# EAGLE design Module-Relay (EAGLE 6.6.0)
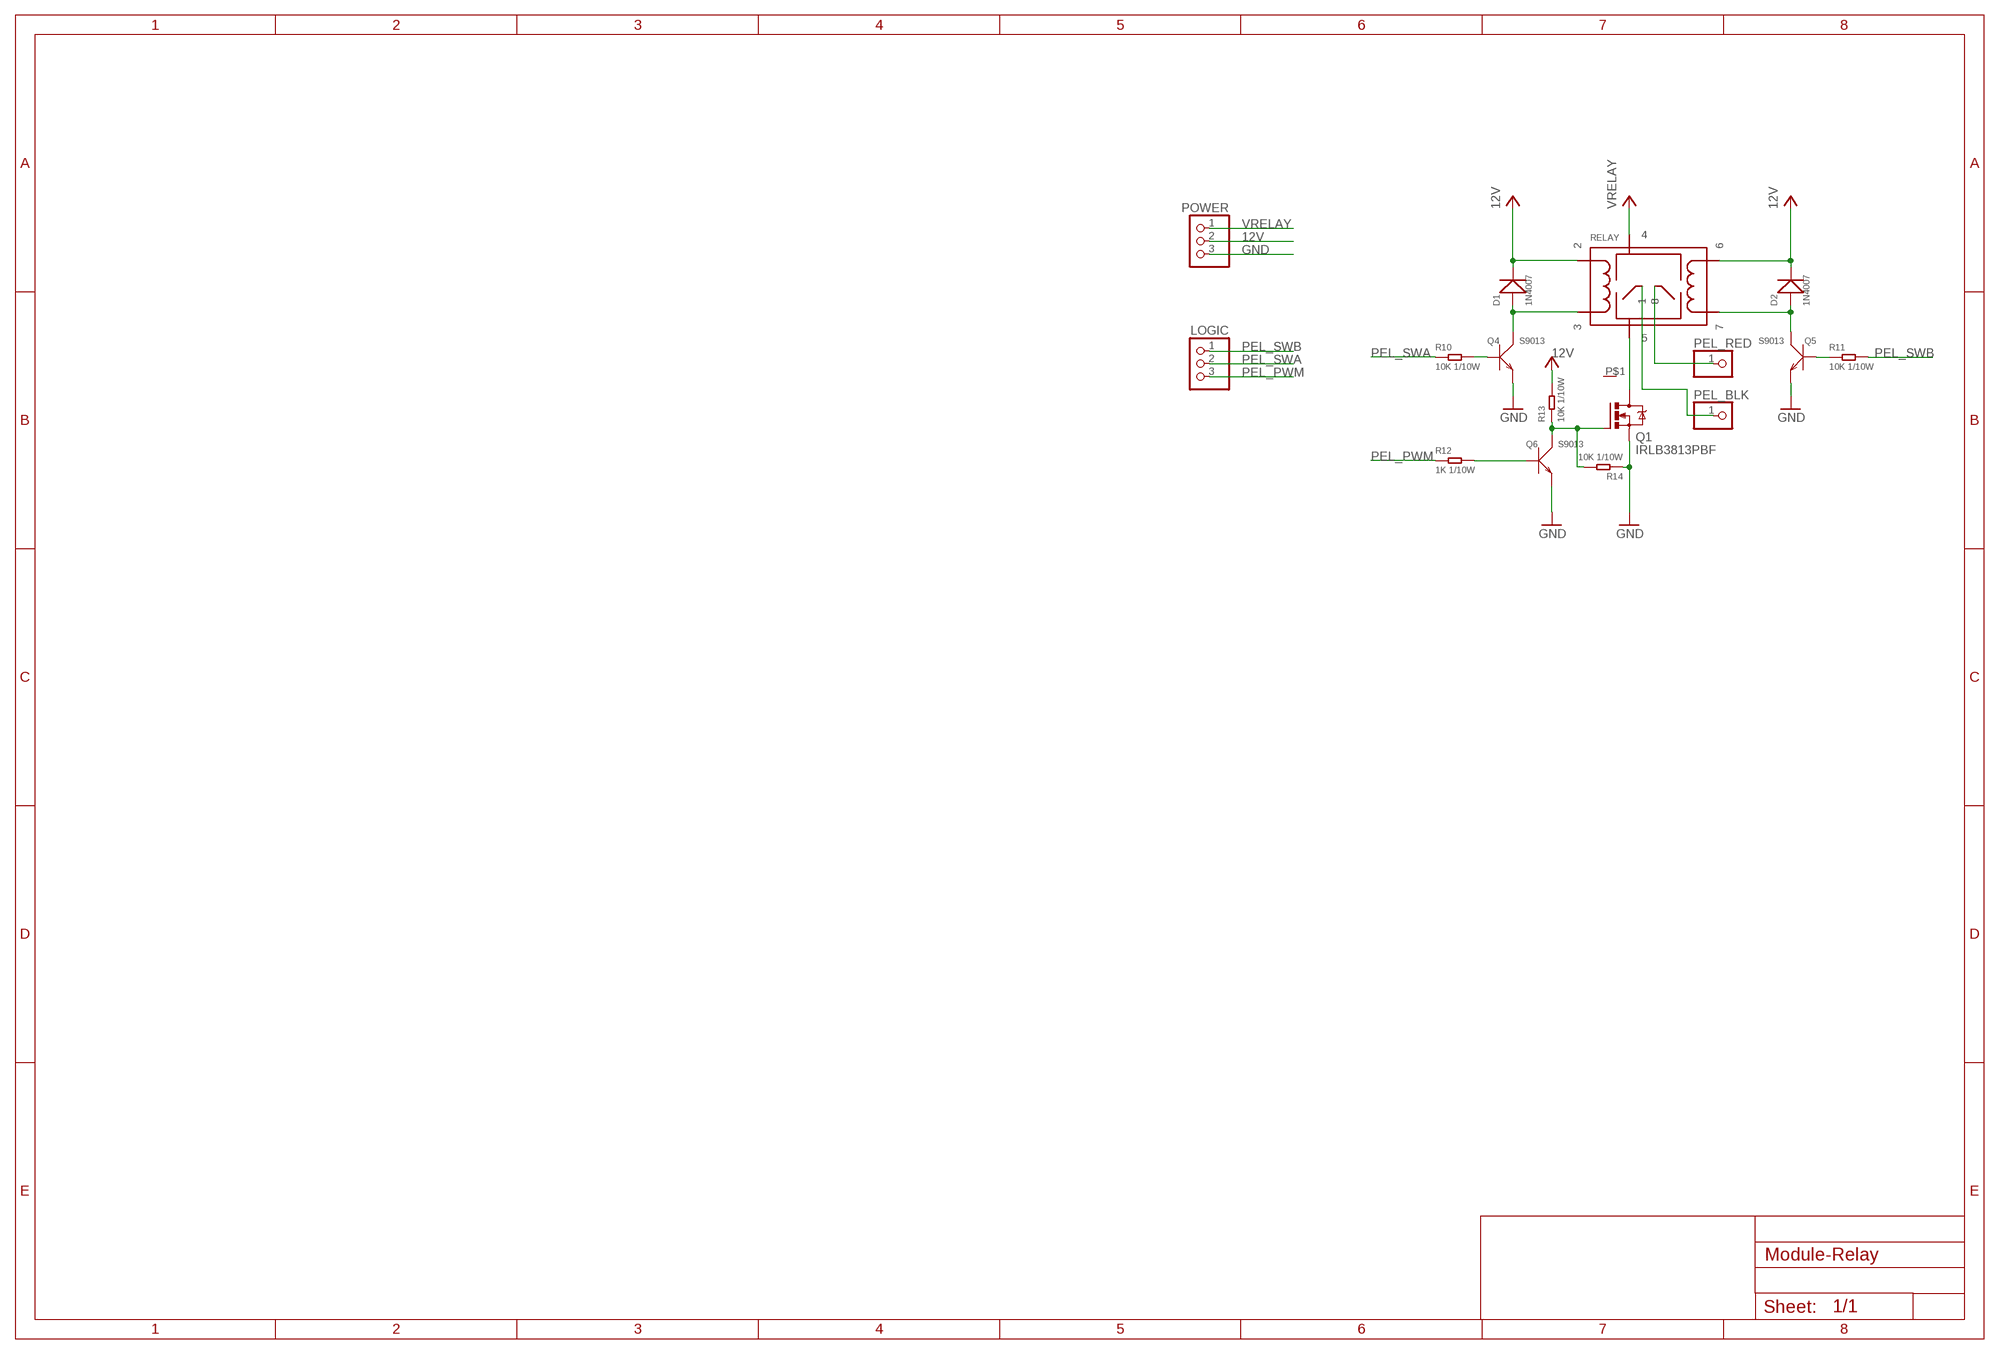
[diagram p0: schematic, sheet 1]

## Parts
D1  1N4007  DIODE-GEN-PURPOSE-1KV-1A(DO-214AC)  [DO-214AC]
D2  1N4007  DIODE-GEN-PURPOSE-1KV-1A(DO-214AC)  [DO-214AC]
HEATSINK  HEAT111PB015  [HEAT11PB015]
LOGIC  PINHD-1X3  [1X03]
PEL_BLK  PINHD-1X1L  [1X01LONG]
PEL_RED  PINHD-1X1L  [1X01LONG]
POWER  PINHD-1X3  [1X03]
Q1  IRLB3813PBF  IRF520  [TO220BV]
Q4  S9013  SMD-TRANSISTORS-NPN-25V-500MA-S9013(SOT-23)  [SOT-23]
Q5  S9013  SMD-TRANSISTORS-NPN-25V-500MA-S9013(SOT-23)  [SOT-23]
Q6  S9013  SMD-TRANSISTORS-NPN-25V-500MA-S9013(SOT-23)  [SOT-23]
R10  10K 1/10W  SMD-RES-10K-5%-1/10W(0603)  [R0603]
R11  10K 1/10W  SMD-RES-10K-5%-1/10W(0603)  [R0603]
R12  1K 1/10W  SMD-RES-1K-5%-1/10W(0603)  [R0603]
R13  10K 1/10W  SMD-RES-10K-5%-1/10W(0603)  [R0603]
R14  10K 1/10W  SMD-RES-10K-5%-1/10W(0603)  [R0603]
RELAY  NEC-RELAY2EP2  [NEC-EP2]

## Nets
12V: D2.2(-) POWER.2 R13.2 RELAY.P$6
GND: POWER.3 Q1.S Q4.2(E) Q5.2(E) Q6.2(E) R14.1
N$3: Q1.D RELAY.P$5
N$5: Q1.G Q6.3(C) R13.1 R14.2
N$6: PEL_RED.1 RELAY.P$8
N$7: PEL_BLK.1 RELAY.P$1
N$9: D1.2(-) RELAY.P$2
N$30: Q6.1(B) R12.2
N$33: D1.1(+) Q4.3(C) RELAY.P$3
N$34: Q4.1(B) R10.2
N$35: Q5.1(B) R11.1
N$36: D2.1(+) Q5.3(C) RELAY.P$7
PEL_PWM: LOGIC.3 R12.1
PEL_SWA: LOGIC.2 R10.1
PEL_SWB: LOGIC.1 R11.2
VRELAY: POWER.1 RELAY.P$4
Unconnected: HEATSINK.P$1

## Library data of the parts
D1 D2 = Seeed-Diode:DIODE-GEN-PURPOSE-1KV-1A(DO-214AC): 304010013; MPN: 1N4007
HEATSINK = PCR-Connector:HEAT1
LOGIC POWER = pinhead:PINHD-1X3: PIN HEADER
PEL_BLK PEL_RED = pinhead:PINHD-1X1: PIN HEADER
Q1 = transistor-power:IRF520: HEXFET Power MOSFET
Q4-Q6 = Seeed-Transistor:SMD-TRANSISTORS-NPN-25V-500MA-S9013(SOT-23): 305010018; MPN: S9013
R10 R11 R13 R14 = Seeed-Resistor:SMD-RES-10K-5%-1/10W(0603): 301010293; MPN: RC0603JR-0710KL
R12 = Seeed-Resistor:SMD-RES-1K-5%-1/10W(0603): 301010291; MPN: RC0603JR-071KL
RELAY = PCR-Switch:NEC-RELAY2

## Net classes
1 2A: width 0.406 mm
2 8A: width 2.54 mm

## Board
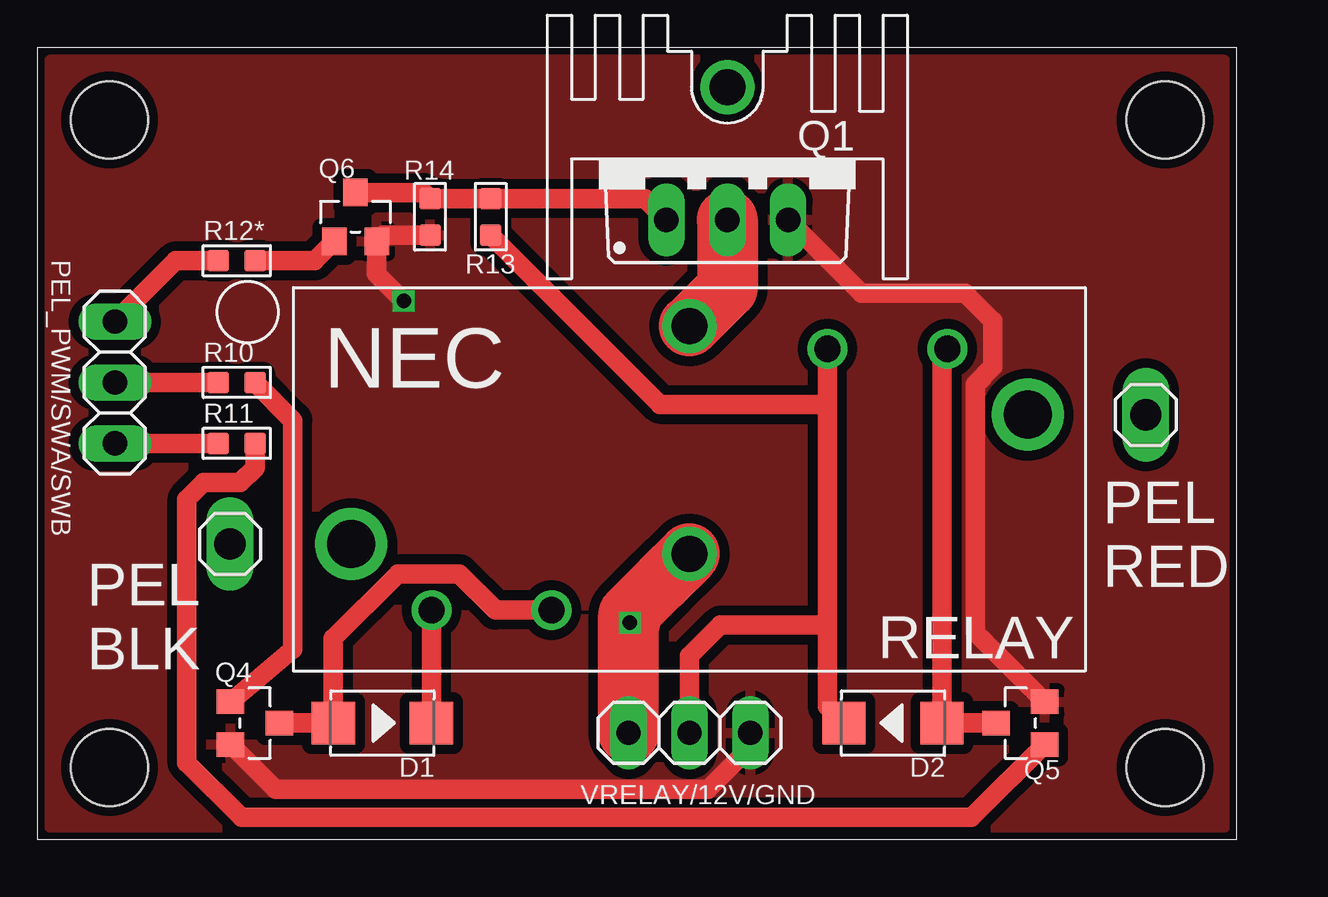
[diagram p1: board, top side]
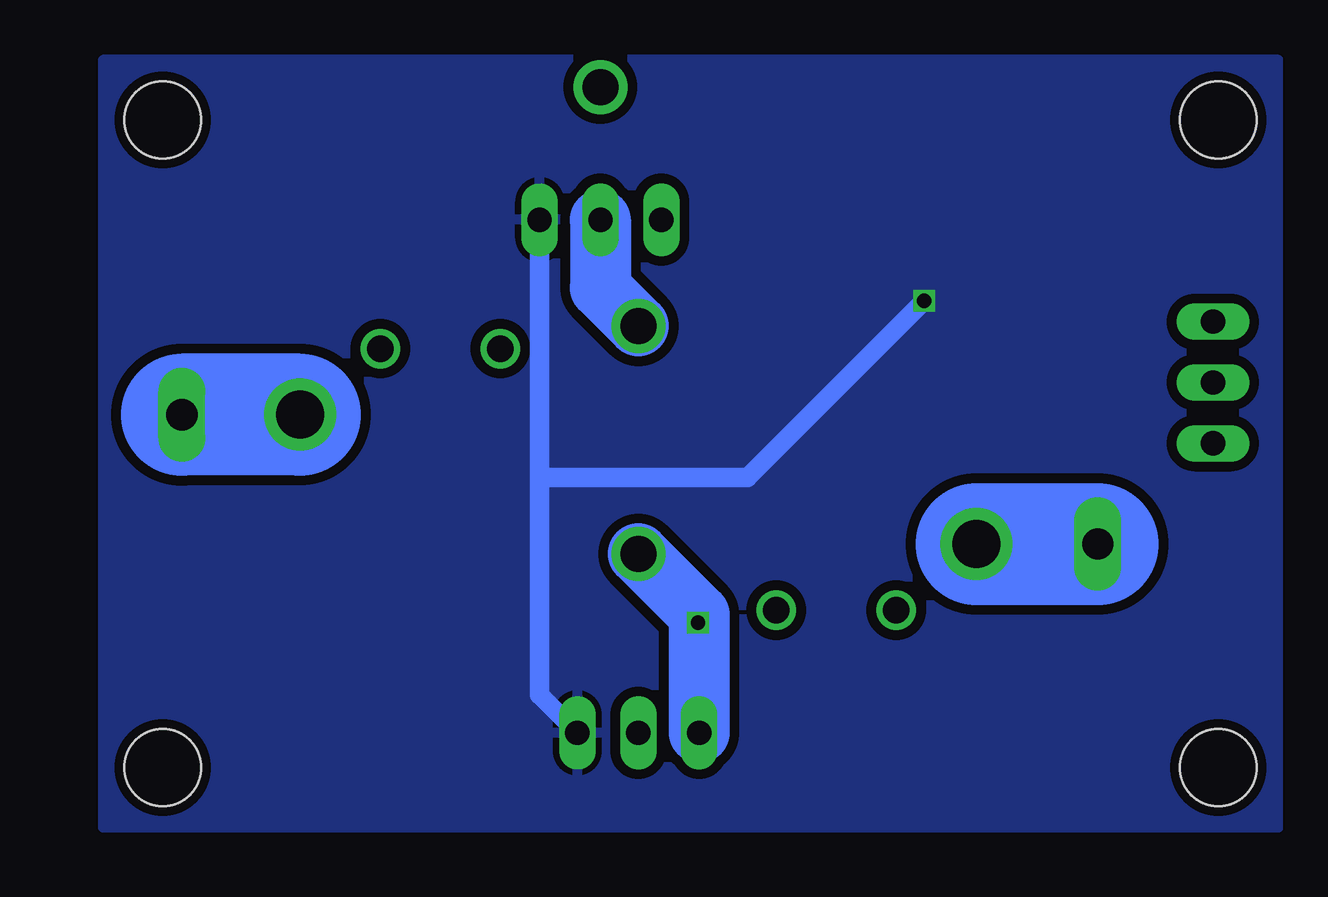
[diagram p2: board, bottom side, seen from below]

No outline drawn. Coordinates in mm, seen from the top.
Copper layers (1*16): Top 0.035mm / dielectric 1.5mm / Bottom 0.035mm
Design rules "SeeedStudio_2layer_DRU_no_angle_20140221": minimum track width 6mil, minimum drill 12mil, track to track 6mil, track to pad 6mil, pad to pad 6mil, via to via 6mil, smd to smd 0mil, copper to edge 10mil, drill to drill 10mil, minimum pad ring 10mil, minimum via ring 6mil, stop-mask expansion 2mil, vias tented up to drill 100mil, thermal gap 10mil
Holes 3.2 mm at 3,30 47,30 47,3 3,3

### Footprints (pad centres in the part's own frame; a part is rotated, then mirrored left to right if it is on the bottom)
DO-214AC = smd 1.8 x 1.77: 1 -2.042,0; 2 2.042,0
HEAT11PB015 = drill 1.5: P$1 0,3
1X03 = drill 1.016 long: 1 -2.54,0; 2 0,0; 3 2.54,0
1X01LONG = drill 1.3 long: 1 0,0
TO220BV = drill 1.016 long: D 0,-2.54; G -2.54,-2.54; S 2.54,-2.54
SOT-23 = smd 1.016 x 1.143: 1 -0.889,-1.016; 2 0.889,-1.016; 3 0,1.016
R0603 = smd 0.889 x 0.889: 1 0,0.762; 2 0,-0.762
NEC-EP2 = drill 2: P$1 -14.1,-2.7; P$8 14.1,2.7 | drill 1.1: P$2 -10.75,-5.45; P$3 -5.75,-5.45; P$6 5.75,5.45; P$7 10.75,5.45 | drill 1.5: P$4 0,-3.1; P$5 0,6.4

### Placement (x,y rotation side)
D1  14.38,4.85 0 top
D2  35.66,4.85 180 top
HEATSINK  28.75,28.37 0 top
LOGIC  3.23,19.05 90 top
PEL_BLK  8.03,12.32 90 top
PEL_RED  46.2,17.7 90 top
POWER  27.18,4.45 0 top
Q1  28.75,28.37 0 top
Q4  9.07,4.85 270 top
Q5  40.97,4.85 90 top
Q6  13.26,25.96 0 top
R10  8.31,19.05 90 top
R11  8.31,16.51 270 top
R12  8.31,24.13 90 top
R13  18.9,25.96 0 top
R14  16.36,25.96 180 top
RELAY  27.18,15.01 0 top

### Tracks (layer width: path | path; a pad name or v marks a point on that pad's centre or on a via)
12V
  Top 0.813: POWER.2 27.18,7.64 28.47,8.94 32.93,8.94 | 32.93,18.14 RELAY.P$6 | R13.2 25.96,18.14 32.93,18.14 | D2.2 32.93,5.54 32.93,8.94 | 32.93,8.94 32.93,18.14
GND  (via drill 0.6)
  Top 0.813: R14.1 14.4,25.2 Q6.2 14.15,23.57 v15.27,22.45 | Q1.S 34.34,22.78 38.66,22.78 39.83,21.61 39.83,19.71 39.09,18.97 39.09,8.64 Q5.2 | Q4.2 9.93,2.08 27.94,2.08 29.72,3.86 POWER.3
  Bottom 0.813: POWER.3 31.29,6.02 31.29,15.09 | 31.29,15.09 Q1.S | v15.27,22.45 22.63,15.09 31.29,15.09
  pour Bottom (isolate 0.406): 0.5,32.5 49.5,32.5 49.5,0.5 0.5,0.5
  pour Top (isolate 0.406): 0.5,32.5 0.5,0.5 49.5,0.5 49.5,32.5
N$3
  Top 2.54: Q1.D 28.75,22.99 RELAY.P$5
  Bottom 2.54: Q1.D 28.75,22.99 RELAY.P$5
N$5
  Top 0.813: Q6.3 16.1,26.98 R14.2 R13.1 25.32,26.72 Q1.G
N$6
  Bottom 5.08: RELAY.P$8 PEL_RED.1
N$7
  Bottom 5.08: RELAY.P$1 PEL_BLK.1
N$9
  Top 0.813: D1.2 RELAY.P$2
N$30
  Top 0.813: R12.2 11.56,24.13 Q6.1
N$33
  Top 0.813: RELAY.P$3 19.09,9.56 17.58,11.07 15.04,11.07 12.33,8.37 D1.1 Q4.3
N$34
  Top 0.813: Q4.1 10.64,7.92 10.64,17.48 R10.2
N$35
  Top 0.813: Q5.1 38.94,0.91 8.51,0.91 6.22,3.2 6.22,14.17 6.93,14.88 8.46,14.88 9.07,15.49 R11.1
N$36
  Top 0.813: Q5.3 D2.1 37.7,20.24 RELAY.P$7
PEL_PWM
  Top 0.813: LOGIC.3 5.77,24.13 R12.1
PEL_SWA
  Top 0.813: R10.1 LOGIC.2
PEL_SWB
  Top 0.813: R11.2 LOGIC.1
VRELAY  (via drill 0.6)
  Top 2.54: POWER.1 24.64,9.37 24.69,9.42 | RELAY.P$4 26.02,10.76 24.69,9.42 | v24.69,9.04 24.69,9.42
  Bottom 2.54: RELAY.P$4 24.64,9.37 POWER.1

### Text on the board
tPlace: Q1 | Q6 | R14 | R12* | PEL_PWM/SWA/SWB | R13 | R10 | R11 | PEL / RED | RELAY | PEL / BLK | Q4 | D1 | D2 | Q5 | VRELAY/12V/GND
tDocu: 50 x 33 mm